# Altium schematic sheet Gyroscope.SchDoc: Gyroscope
size A4; Author: Jason Zhou; Engineer: Jason Zhou; SheetNumber: 4; SheetTotal: 6; Projectidentifier: V5 Co-processor
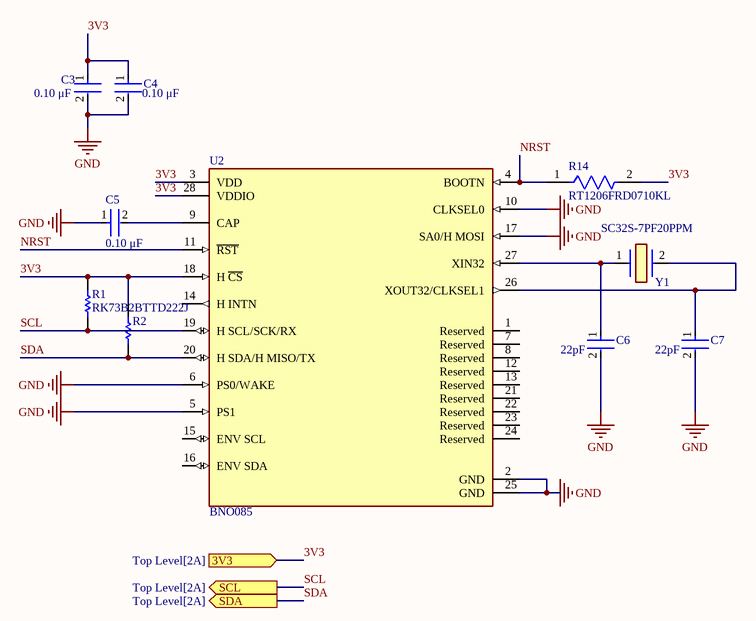
[diagram p0: Gyroscope.SchDoc]

## Parts
C3  Capacitance: 0.10 μF  [FP-C1206C-EB-MFG]  (hidden comment: C1206C104M5RACTU)
C4  Capacitance: 0.10 μF  [FP-C1206C-EB-MFG]  (hidden comment: C1206C104M5RACTU)
C5  Capacitance: 0.10 μF  [FP-C1206C-EB-MFG]  (hidden comment: C1206C104M5RACTU)
C6  Capacitance: 22pF  [FP-CL31-IPC_A]  (hidden comment: CL31C220JBCNNNC)
C7  Capacitance: 22pF  [FP-CL31-IPC_A]  (hidden comment: CL31C220JBCNNNC)
R1  RK73B2BTTD222J  [RESC3216X70X40LL20T20]
R2  RK73B2BTTD222J  [RESC3216X70X40LL20T20]  (value not drawn)
R14  RT1206FRD0710KL  [FP-RT1206-MFG]
U2  BNO085  [FP-BNO085-MFG]
Y1  SC32S-7PF20PPM  [SC32S7PF20PPM]

## Ports
3V3 (in, see Top Level[2A]), SCL (out, see Top Level[2A]), SDA (out, see Top Level[2A])

## Nets
GND: C3.2 C4.2 C5.1 C6.2 C7.2 U2.2(GND) U2.5(PS1) U2.6(PS0/WAKE) U2.10(CLKSEL0) U2.17(SA0/H_MOSI) U2.25(GND)
3V3: C3.1 C4.1 R1.2 R2.2 R14.2 U2.3(VDD) U2.18(H_~{CS}) U2.28(VDDIO) ; port 3V3
NRST: R14.1 U2.4(BOOTN) U2.11(~{RST})
SCL: R1.1 U2.19(H_SCL/SCK/RX) ; port SCL
SDA: R2.1 U2.20(H_SDA/H_MISO/TX) ; port SDA
NetC5_2: C5.2 U2.9(CAP)
NetC6_1: C6.1 U2.27(XIN32) Y1.1
NetC7_1: C7.1 U2.26(XOUT32/CLKSEL1) Y1.2

Not connected (* = marked no-connect by the designer): U2 1(Reserved) 7(Reserved) 8(Reserved) 12(Reserved) 13(Reserved) 14(H_INTN) 15(ENV_SCL) 16(ENV_SDA) 21(Reserved) 22(Reserved) 23(Reserved) 24(Reserved)

## Notes on the sheet
- Size:
- Date:
- Title
- A4
- Project:
- Time:
- Revision:
- Sheet
- of
- Engineer
- File:

## Library data of the parts
C3-C5 = CMP-03020-028488-1: CAP CER 0.1UF 50V X7R 1206; Manufacturer: KEMET; Material: Ceramic; Automotive Grade: Grade 0; Value: 0.10 μF; Tolerance: 0.2; Temperature Coefficient: 15%; Device Class L3: Ceramic Capacitors; Device Class L1: Passive Components; Category: Cap; Octopart: https://octopart.com/c1206c104m5ractu-kemet-129344; Temperature Range Low: -55°C; RoHS: TRUE; Manufacturer Part Number: C1206C104M5RACTU; Lead Free: Yes; Package: C1206C-EB; Digikey Description: CAP CER 0.1UF 50V X7R 1206; Automotive: Yes; Height: 0.88mm; Device Class L2: Capacitors; ComponentLink2Description: Datasheet; Mouser Description: Multilayer Ceramic Capacitors MLCC - SMD/SMT 50volts 0.1uF X7R 20%; Temperature: -55°C to +150°C; Temperature Characteristic: X7R; ComponentLink2URL: https://content.kemet.com/datasheets/KEM_C1007_X8R_ULTRA_150C_SMD.pdf; Ipc Land Pattern Name: CAPC320160X78; Temperature Range High: +150°C; Voltage Rating: 50 V
C6 C7 = CMP-13271-001055-1: Cap Ceramic 22pF 50V C0G ±5% SMD 1206 +125°C Embossed T/R; Temperature Coefficient: 300ppm/°C; Packaging: Tape and Reel; Material: Ceramic; Package Quantity: 1; Thickness: 0.039inch; Voltage: 50V; Height: 0.85mm; Radiation Hardening: No; Mount: Surface Mount; Width: 0.063inch; Min Operating Temperature: -55°C; Max Operating Temperature: 125°C; Voltage Rating (DC): 50V; Voltage Rating: 50V; Case/Package: 1206; Case Code (Metric): 3216; Tolerance: 5%; Length: 3.2mm; Dielectric: C0G; Lead Free: Lead Free; Depth: 1.6mm; Case Code (Imperial): 1206
R1 R2 = CMP-2003-04576-1: Manufacturer: KOA Speer; Part Number: RK73B2BTTD222J
R14 = CMP-03412-004711-1: RES SMD 10K OHM 1% 1/4W 1206; Manufacturer: Yageo; Description: RT1206 10KΩ 0.25W 25 ppm/°C 0.02%; Voltage Rating: 200V; Power Rating: 0.25W; Tolerance: 0.0002; Value: 10KΩ; Temperature Coefficient: 25 ppm/°C; Series: RT; Composition: Thin Film; Device Class L3: Chip SMD Resistors; Temperature: -55°C to +155°C; Device Class L1: Passive Components; ComponentLink2Description: Datasheet; Lead Free: Yes; ComponentLink2URL: http://www.yageo.com/documents/recent/PYu-RT_1-to-0.01_RoHS_L_9.pdf; Footprint Url: http://www.yageo.com/exep/pages/download/literatures/PYu-R_Mount_10.pdf; Height: 0.65mm; Ipc Land Pattern Name: RESC310160X55; Device Class L2: Resistors; Category: Res; Package: RT1206; Manufacturer Part Number: RT1206FRD0710KL; RoHS: TRUE; Digikey Description: RES SMD 10K OHM 1% 1/4W 1206; Automotive: No; Temperature Range High: +155°C; Resistance: 10KΩ; Octopart: https://octopart.com/rt1206frd0710kl-yageo-71404185; Temperature Range Low: -55°C
U2 = CMP-031-00006-4: IMU ACCEL/GYRO/MAG I2C 32BIT
Y1 = SC32S-7PF20PPM: Crystal or Oscillator; Manufacturer_Name: Seiko Semiconductors; Datasheet Link: https://www.mouser.com/datasheet/2/360/file_PRODUCT_MASTER_50812_GRAPHIC03-542305.pdf; Manufacturer_Part_Number: SC32S-7PF20PPM; Mouser Part Number: 628-SC32S-7PF20PPM; Mouser Price/Stock: https://www.mouser.co.uk/ProductDetail/Seiko-Semiconductors/SC32S-7PF20PPM?qs=3CPZD7qAgigZSR1ASVAS6w%3D%3D